# EAGLE schematic hid (EAGLE 6.5.0)
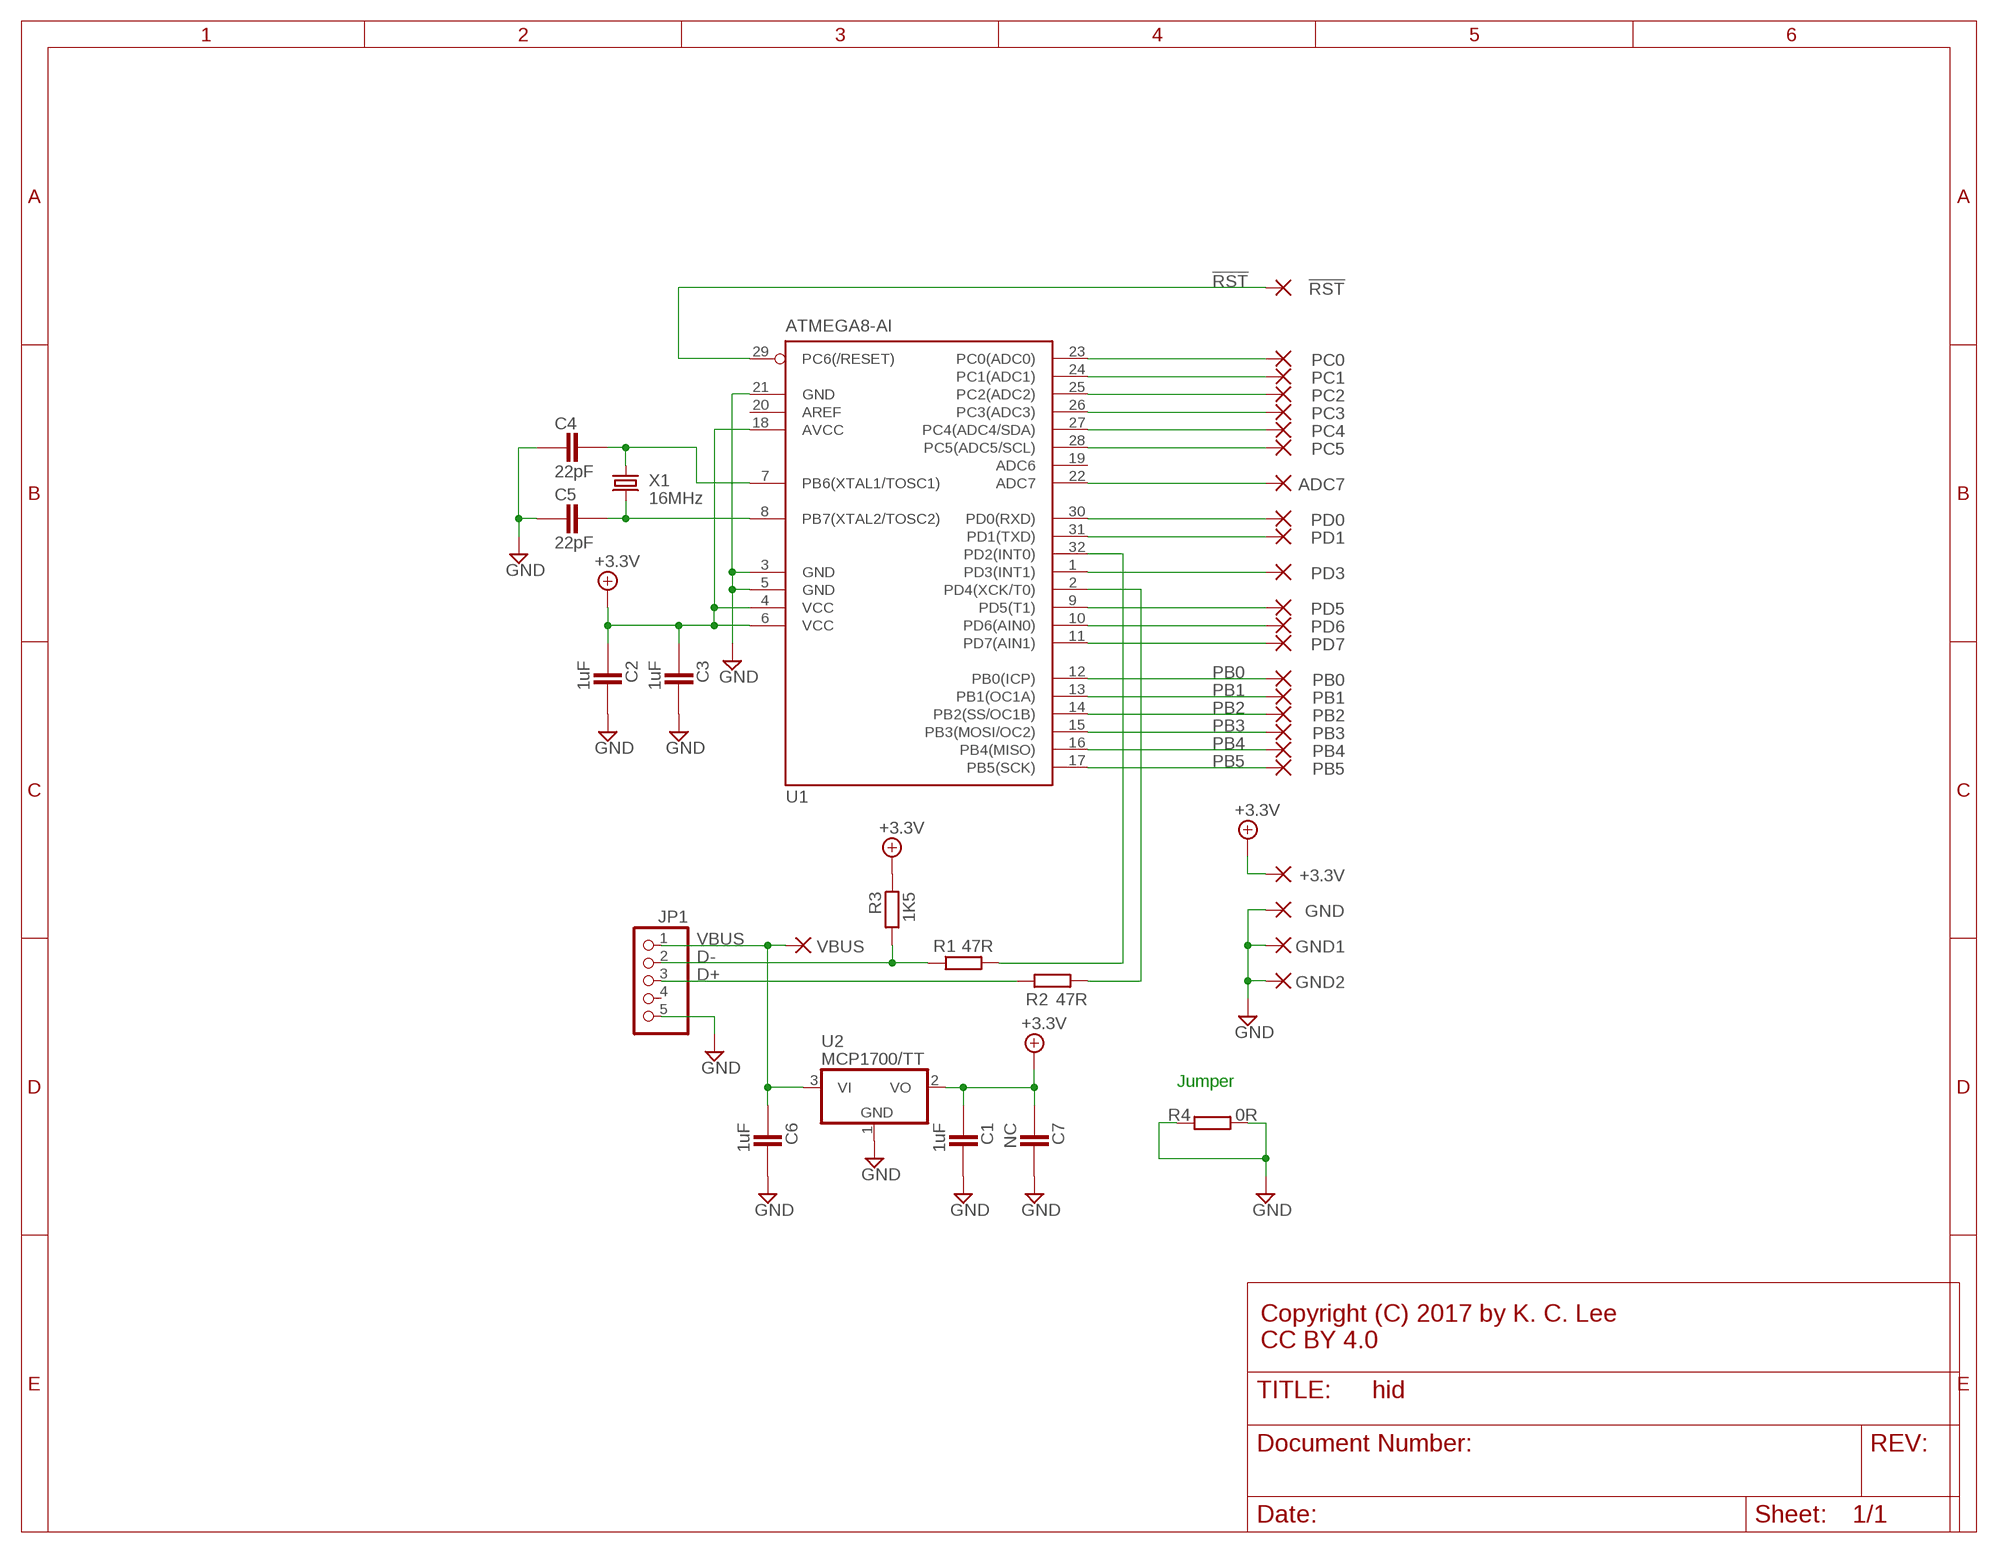
[diagram p0: schematic, sheet 1]

## Parts
!RST  SMD2  [SMD1,27-2,54]
+3.3V  SMD2  [SMD1,27-2,54]
ADC7  SMD2  [SMD1,27-2,54]
C1  1uF  CAPACITOR_0603  [CAPC1608X92N]
C2  1uF  CAPACITOR_0603  [CAPC1608X92N]
C3  1uF  CAPACITOR_0603  [CAPC1608X92N]
C4  22pF  CAPACITOR_0603  [CAPC1608X92N]
C5  22pF  CAPACITOR_0603  [CAPC1608X92N]
C6  1uF  CAPACITOR_0603  [CAPC1608X92N]
C7  NC  CAPACITOR_0805  [CAPC2012X145AN]
GND  SMD2  [SMD1,27-2,54]
GND1  SMD2  [SMD1,27-2,54]
GND2  SMD2  [SMD1,27-2,54]
JP1  PINHD-1X5_2.54  [1X05]
PB0  SMD2  [SMD1,27-2,54]
PB1  SMD2  [SMD1,27-2,54]
PB2  SMD2  [SMD1,27-2,54]
PB3  SMD2  [SMD1,27-2,54]
PB4  SMD2  [SMD1,27-2,54]
PB5  SMD2  [SMD1,27-2,54]
PC0  SMD2  [SMD1,27-2,54]
PC1  SMD2  [SMD1,27-2,54]
PC2  SMD2  [SMD1,27-2,54]
PC3  SMD2  [SMD1,27-2,54]
PC4  SMD2  [SMD1,27-2,54]
PC5  SMD2  [SMD1,27-2,54]
PD0  SMD2  [SMD1,27-2,54]
PD1  SMD2  [SMD1,27-2,54]
PD3  SMD2  [SMD1,27-2,54]
PD5  SMD2  [SMD1,27-2,54]
PD6  SMD2  [SMD1,27-2,54]
PD7  SMD2  [SMD1,27-2,54]
R1  47R  RESISTOR_0603  [RESC1608X55N]
R2  47R  RESISTOR_0603  [RESC1608X55N]
R3  1K5  RESISTOR_0603  [RESC1608X55N]
R4  0R  RESISTOR_1206  [RESC3115X70N]
U1  ATMEGA8-AI  MEGA8-AI  [TQFP32-08]
U2  MCP1700/TT  [SOT95P280X135-3N]
VBUS  SMD2  [SMD1,27-2,54]
X1  16MHz  CRYSTALTC26H  [TC26H]

## Nets
!RST: !RST.1(P) U1.29(PC6(/RESET))
+3.3V: +3.3V.1(P) C1.1 C2.1 C3.1 C7.1 R3.1 U1.4(VCC) U1.6(VCC) U1.18(AVCC) U2.2(VO)
D2: R1.2 U1.32(PD2(INT0))
D4: R2.2 U1.2(PD4(XCK/T0))
D+: JP1.3 R2.1
D-: JP1.2 R1.1 R3.2
GND: C1.2 C2.2 C3.2 C4.1 C5.1 C6.2 C7.2 GND1.1(P) GND2.1(P) GND.1(P) JP1.5 R4.1 R4.2 U1.3(GND) U1.5(GND) U1.21(GND) U2.1(GND)
N$2: PD7.1(P) U1.11(PD7(AIN1))
N$3: PD6.1(P) U1.10(PD6(AIN0))
N$4: PD5.1(P) U1.9(PD5(T1))
N$5: PD0.1(P) U1.30(PD0(RXD))
N$6: PD3.1(P) U1.1(PD3(INT1))
N$7: PD1.1(P) U1.31(PD1(TXD))
N$8: PC5.1(P) U1.28(PC5(ADC5/SCL))
N$9: PC4.1(P) U1.27(PC4(ADC4/SDA))
N$10: PC3.1(P) U1.26(PC3(ADC3))
N$11: PC2.1(P) U1.25(PC2(ADC2))
N$12: PC1.1(P) U1.24(PC1(ADC1))
N$13: PC0.1(P) U1.23(PC0(ADC0))
N$14: ADC7.1(P) U1.22(ADC7)
N$22: C4.2 U1.7(PB6(XTAL1/TOSC1)) X1.1
N$23: C5.2 U1.8(PB7(XTAL2/TOSC2)) X1.2
PB0: PB0.1(P) U1.12(PB0(ICP))
PB1: PB1.1(P) U1.13(PB1(OC1A))
PB2: PB2.1(P) U1.14(PB2(SS/OC1B))
PB3: PB3.1(P) U1.15(PB3(MOSI/OC2))
PB4: PB4.1(P) U1.16(PB4(MISO))
PB5: PB5.1(P) U1.17(PB5(SCK))
VBUS: C6.1 JP1.1 U2.3(VI) VBUS.1(P)
Unconnected: JP1.4 U1.19(ADC6) U1.20(AREF)

## Notes on the sheet
- Jumper
- Copyright (C) 2017 by K. C. Lee
  CC BY 4.0

## Library data of the parts
!RST +3.3V ADC7 GND GND1 GND2 PB0 PB1-PB5 PC0 PC1-PC5 PD0 PD1 PD3 PD5-PD7 VBUS = wirepad:SMD2: SMD PAD; PARTNO: Breakout
C1-C3 C6 = ipc-7351-capacitor:CAPACITOR_; PARTNO: 1uF X7R 0603
C4 C5 = ipc-7351-capacitor:CAPACITOR_; PARTNO: 22pF 0603
C7 = ipc-7351-capacitor:CAPACITOR_; PARTNO: NC 0805
JP1 = pinhead-1:PINHD-1X5: PIN HEADER; PARTNO: *
R1 R2 = ipc-7351-resistor:RESISTOR_; PARTNO: 47R 0603
R3 = ipc-7351-resistor:RESISTOR_; PARTNO: 1K5 0603
R4 = ipc-7351-resistor:RESISTOR_; PARTNO: 0R 1206
U1 = atmel:MEGA8: MICROCONTROLLER 8 Kbytes FLASH, 1 kbytes SRAM, 512 bytes EEPROM, USART, 6-channel 10 bit ADC, 2-channel 8 bit ADC Pin compatible with Atmega48, ATMega88, ATMega168 Source: avr.lbr; PARTNO: ATmega8A-AU
U2 = Misc Power:MCP1700; PARTNO: MCP1700T-3302E/TT
X1 = crystal:CRYSTAL: CRYSTAL; PARTNO: 16MHz Crystal TC26